# EasyEDA schematic SCH_lights_2024-05-02.json
TITLE: Sheet_2; REV: 1.0; Date: 2024-04-28; Sheet: 1/1; Drawn By: arnav.purbiya; Company: Your Company
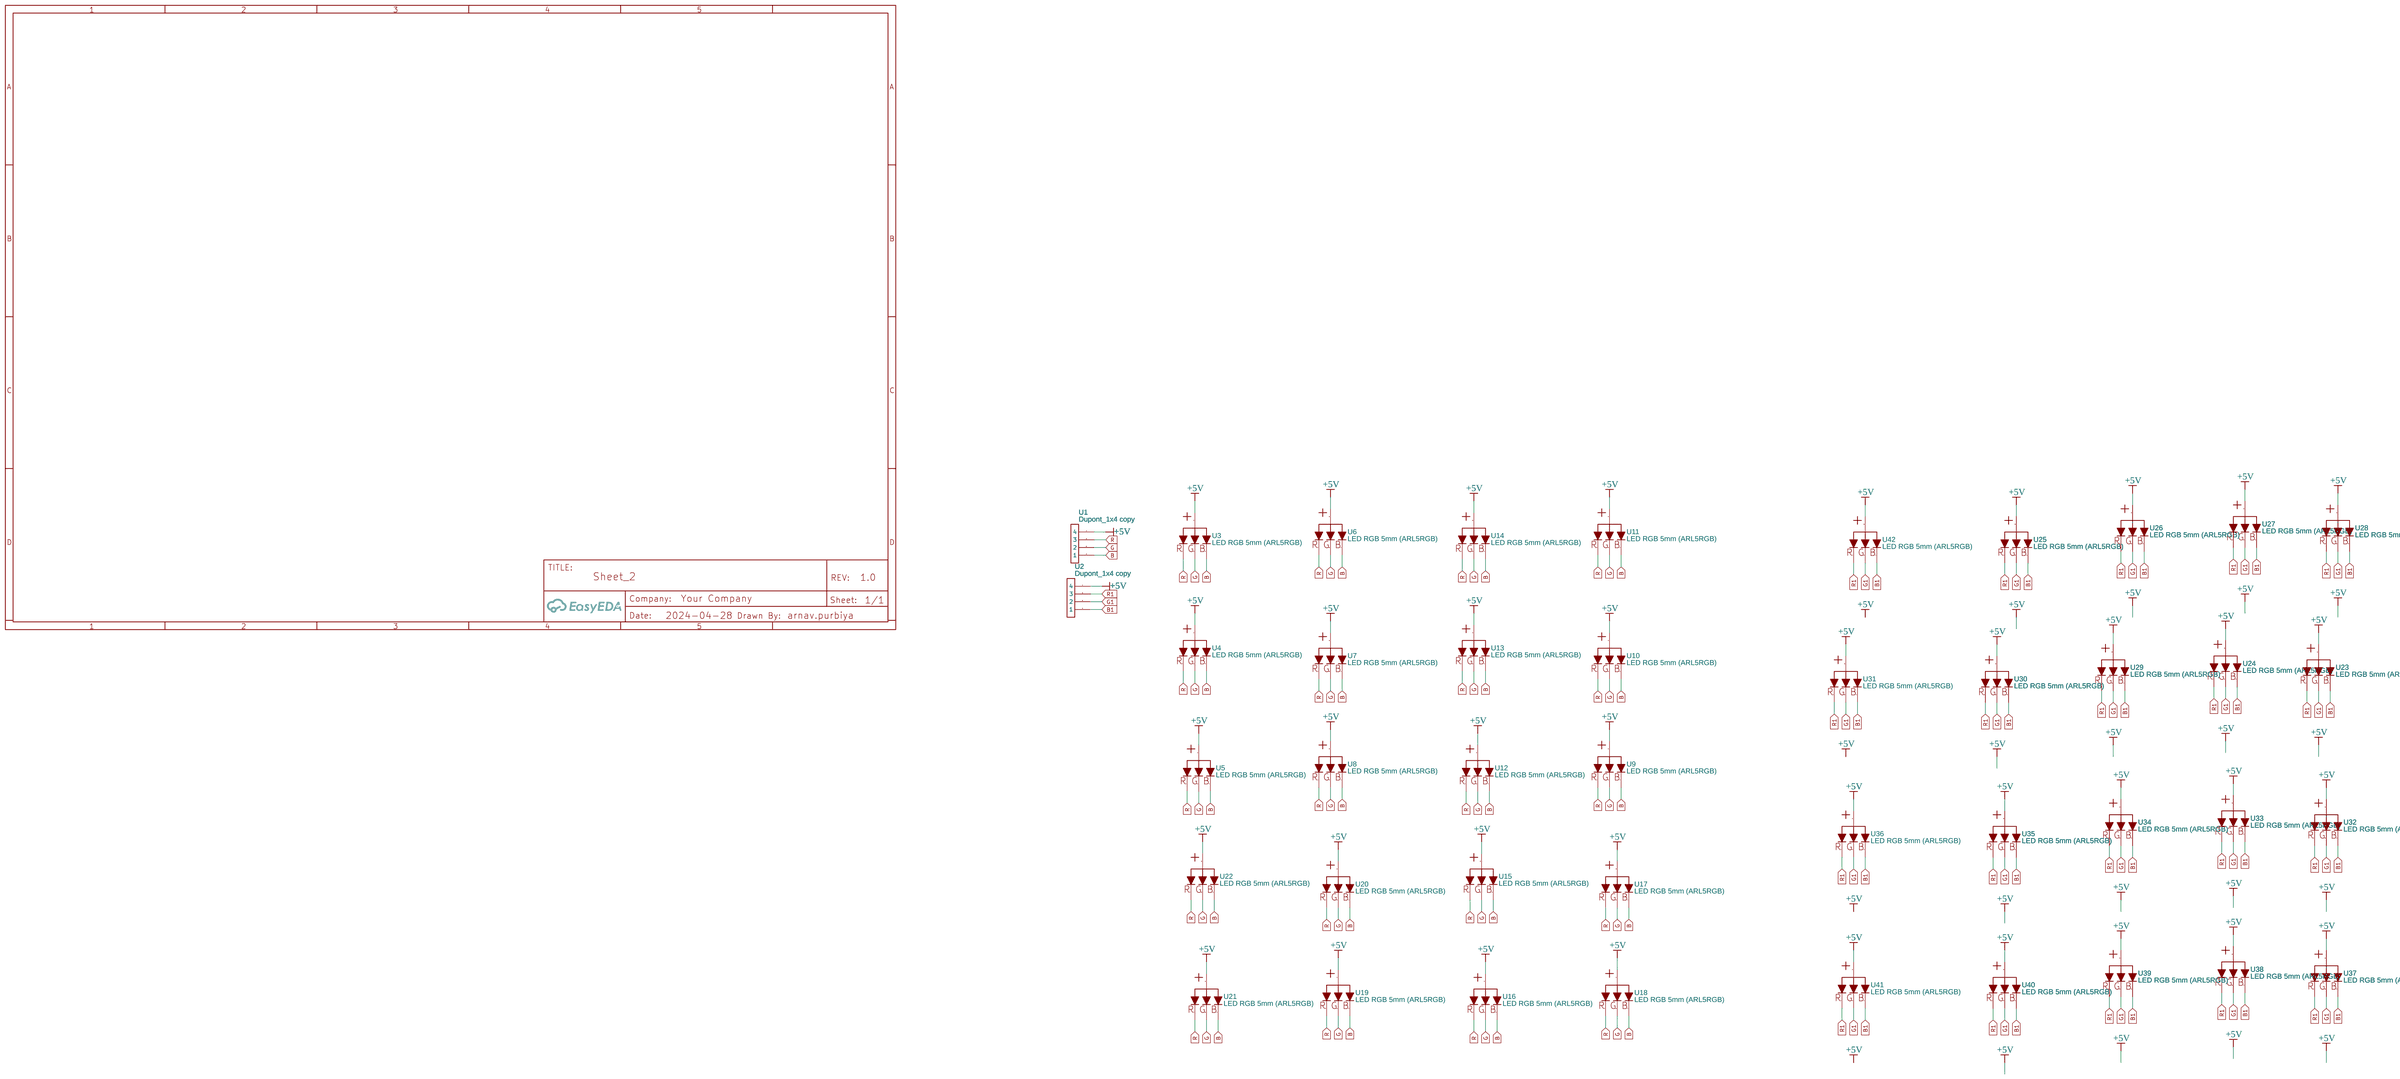
[diagram p0: schematic sheet]

## Parts
U1  Dupont_1x4 copy  [DUPONT_1X4]
U2  Dupont_1x4 copy  [DUPONT_1X4]
U3  LED RGB 5mm (ARL5RGB)  [LED RGB 5MM (ARL5RGB)]
U4  LED RGB 5mm (ARL5RGB)  [LED RGB 5MM (ARL5RGB)]
U5  LED RGB 5mm (ARL5RGB)  [LED RGB 5MM (ARL5RGB)]
U6  LED RGB 5mm (ARL5RGB)  [LED RGB 5MM (ARL5RGB)]
U7  LED RGB 5mm (ARL5RGB)  [LED RGB 5MM (ARL5RGB)]
U8  LED RGB 5mm (ARL5RGB)  [LED RGB 5MM (ARL5RGB)]
U9  LED RGB 5mm (ARL5RGB)  [LED RGB 5MM (ARL5RGB)]
U10  LED RGB 5mm (ARL5RGB)  [LED RGB 5MM (ARL5RGB)]
U11  LED RGB 5mm (ARL5RGB)  [LED RGB 5MM (ARL5RGB)]
U12  LED RGB 5mm (ARL5RGB)  [LED RGB 5MM (ARL5RGB)]
U13  LED RGB 5mm (ARL5RGB)  [LED RGB 5MM (ARL5RGB)]
U14  LED RGB 5mm (ARL5RGB)  [LED RGB 5MM (ARL5RGB)]
U15  LED RGB 5mm (ARL5RGB)  [LED RGB 5MM (ARL5RGB)]
U16  LED RGB 5mm (ARL5RGB)  [LED RGB 5MM (ARL5RGB)]
U17  LED RGB 5mm (ARL5RGB)  [LED RGB 5MM (ARL5RGB)]
U18  LED RGB 5mm (ARL5RGB)  [LED RGB 5MM (ARL5RGB)]
U19  LED RGB 5mm (ARL5RGB)  [LED RGB 5MM (ARL5RGB)]
U20  LED RGB 5mm (ARL5RGB)  [LED RGB 5MM (ARL5RGB)]
U21  LED RGB 5mm (ARL5RGB)  [LED RGB 5MM (ARL5RGB)]
U22  LED RGB 5mm (ARL5RGB)  [LED RGB 5MM (ARL5RGB)]
U23  LED RGB 5mm (ARL5RGB)  [LED RGB 5MM (ARL5RGB)]
U24  LED RGB 5mm (ARL5RGB)  [LED RGB 5MM (ARL5RGB)]
U25  LED RGB 5mm (ARL5RGB)  [LED RGB 5MM (ARL5RGB)]
U26  LED RGB 5mm (ARL5RGB)  [LED RGB 5MM (ARL5RGB)]
U27  LED RGB 5mm (ARL5RGB)  [LED RGB 5MM (ARL5RGB)]
U28  LED RGB 5mm (ARL5RGB)  [LED RGB 5MM (ARL5RGB)]
U29  LED RGB 5mm (ARL5RGB)  [LED RGB 5MM (ARL5RGB)]
U30  LED RGB 5mm (ARL5RGB)  [LED RGB 5MM (ARL5RGB)]
U31  LED RGB 5mm (ARL5RGB)  [LED RGB 5MM (ARL5RGB)]
U32  LED RGB 5mm (ARL5RGB)  [LED RGB 5MM (ARL5RGB)]
U33  LED RGB 5mm (ARL5RGB)  [LED RGB 5MM (ARL5RGB)]
U34  LED RGB 5mm (ARL5RGB)  [LED RGB 5MM (ARL5RGB)]
U35  LED RGB 5mm (ARL5RGB)  [LED RGB 5MM (ARL5RGB)]
U36  LED RGB 5mm (ARL5RGB)  [LED RGB 5MM (ARL5RGB)]
U37  LED RGB 5mm (ARL5RGB)  [LED RGB 5MM (ARL5RGB)]
U38  LED RGB 5mm (ARL5RGB)  [LED RGB 5MM (ARL5RGB)]
U39  LED RGB 5mm (ARL5RGB)  [LED RGB 5MM (ARL5RGB)]
U40  LED RGB 5mm (ARL5RGB)  [LED RGB 5MM (ARL5RGB)]
U41  LED RGB 5mm (ARL5RGB)  [LED RGB 5MM (ARL5RGB)]
U42  LED RGB 5mm (ARL5RGB)  [LED RGB 5MM (ARL5RGB)]

## Library data of the parts
U1 U2 = Dupont_1x4 copy: Manufacturer Part: Conector_dupont; Contributor: invenitec
U3-U42 = LED RGB 5mm (ARL5RGB): Contributor: loicmm22

## Nets
+5V: U1.4 U2.4 U3.2(4) U4.2(4) U5.2(4) U6.2(4) U7.2(4) U8.2(4) U9.2(4) U10.2(4) U11.2(4) U12.2(4) U13.2(4) U14.2(4) U15.2(4) U16.2(4) U17.2(4) U18.2(4) U19.2(4) U20.2(4) U21.2(4) U22.2(4) U23.2(4) U24.2(4) U25.2(4) U26.2(4) U27.2(4) U28.2(4) U29.2(4) U30.2(4) U31.2(4) U32.2(4) U33.2(4) U34.2(4) U35.2(4) U36.2(4) U37.2(4) U38.2(4) U39.2(4) U40.2(4) U41.2(4) U42.2(4)
B: U1.1 U3.4(3) U4.4(3) U5.4(3) U6.4(3) U7.4(3) U8.4(3) U9.4(3) U10.4(3) U11.4(3) U12.4(3) U13.4(3) U14.4(3) U15.4(3) U16.4(3) U17.4(3) U18.4(3) U19.4(3) U20.4(3) U21.4(3) U22.4(3)
B1: U2.1 U23.4(3) U24.4(3) U25.4(3) U26.4(3) U27.4(3) U28.4(3) U29.4(3) U30.4(3) U31.4(3) U32.4(3) U33.4(3) U34.4(3) U35.4(3) U36.4(3) U37.4(3) U38.4(3) U39.4(3) U40.4(3) U41.4(3) U42.4(3)
G: U1.2 U3.3(2) U4.3(2) U5.3(2) U6.3(2) U7.3(2) U8.3(2) U9.3(2) U10.3(2) U11.3(2) U12.3(2) U13.3(2) U14.3(2) U15.3(2) U16.3(2) U17.3(2) U18.3(2) U19.3(2) U20.3(2) U21.3(2) U22.3(2)
G1: U2.2 U23.3(2) U24.3(2) U25.3(2) U26.3(2) U27.3(2) U28.3(2) U29.3(2) U30.3(2) U31.3(2) U32.3(2) U33.3(2) U34.3(2) U35.3(2) U36.3(2) U37.3(2) U38.3(2) U39.3(2) U40.3(2) U41.3(2) U42.3(2)
R: U1.3 U3.1 U4.1 U5.1 U6.1 U7.1 U8.1 U9.1 U10.1 U11.1 U12.1 U13.1 U14.1 U15.1 U16.1 U17.1 U18.1 U19.1 U20.1 U21.1 U22.1
R1: U2.3 U23.1 U24.1 U25.1 U26.1 U27.1 U28.1 U29.1 U30.1 U31.1 U32.1 U33.1 U34.1 U35.1 U36.1 U37.1 U38.1 U39.1 U40.1 U41.1 U42.1
